# Altium schematic sheet IF_amp.SchDoc
size A4
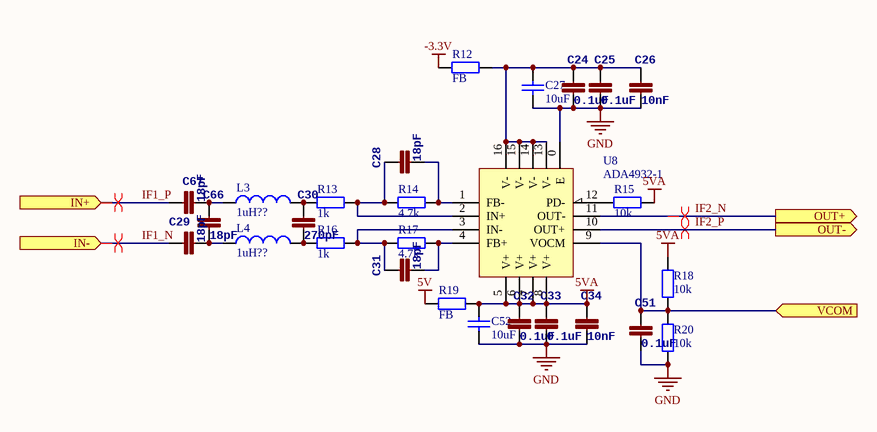
[diagram p0: IF_amp.SchDoc]

## Parts
C24  0.1uF  [0402]
C25  0.1uF  [0402]
C26  10nF  [0402]
C27  10uF  [0805]
C28  18pF  [0402]
C29  18pF  [0402]
C30  270pF  [0402]
C31  18pF  [0402]
C32  0.1uF  [0402]
C33  0.1uF  [0402]
C34  10nF  [0402]
C51  0.1uF  [0402]
C52  10uF  [0805]
C66  18pF  [0402]
C67  18pF  [0402]
L3  value 1uH??  [0805]  (hidden comment: Inductor)
L4  value 1uH??  [0805]  (hidden comment: Inductor)
R12  FB  [0603]
R13  value 1k  [0402]  (hidden comment: Res2)
R14  value 4.7k  [0402]  (hidden comment: Res2)
R15  value 10k  [0402]  (hidden comment: Res2)
R16  value 1k  [0402]  (hidden comment: Res2)
R17  value 4.7k  [0402]  (hidden comment: Res2)
R18  value 10k  [0402]  (hidden comment: Res2)
R19  FB  [0603]
R20  value 10k  [0402]  (hidden comment: Res2)
U8  ADA4932-1  [ADA4932-1]

## Ports
IN+ (in), IN- (in), OUT+ (out), OUT- (out), VCOM (in)

## Nets
5V: R19.1
5VA: C32.2 C33.2 C34.2 C52.1 R15.2 R18.2 R19.2 U8.5(V+) U8.6(V+) U8.7(V+) U8.8(V+)
-3.3V: R12.1
GND: C24.1 C25.1 C26.1 C27.2 C32.1 C33.1 C34.1 C51.1 C52.2 R20.1 U8.0(E)
IF1_N: C29.2 ; port IN-
IF1_P: C67.2 ; port IN+
IF2_N: U8.11(OUT-) ; port OUT+
IF2_P: U8.10(OUT+) ; port OUT-
VCOM: C51.2 R18.1 R20.2 U8.9(VOCM) ; port VCOM
NetC24_2: C24.2 C25.2 C26.2 C27.1 R12.2 U8.13(V-) U8.14(V-) U8.15(V-) U8.16(V-)
NetC28_1: C28.1 R14.2 U8.1(FB-)
NetC28_2: C28.2 R13.2 R14.1 U8.2(IN+)
NetC29_1: C29.1 C66.1 L4.1
NetC30_1: C30.1 L4.2 R16.1
NetC30_2: C30.2 L3.2 R13.1
NetC31_1: C31.1 R17.2 U8.4(FB+)
NetC31_2: C31.2 R16.2 R17.1 U8.3(IN-)
NetC66_2: C66.2 C67.1 L3.1
NetR15_1: R15.1 U8.12(PD-)

## Layout directives
differential pair: IF1_N, IF1_P, IF2_N, IF2_P

## Library data of the parts
C24-C26 C28-C34 C51 C66 C67 = CAP0402-CAP: <b>Capacitor</b> / Standard 0603 ceramic capacitor, and 0.1" leaded capacitor.; PARTNO: CC0402ZRY5V7BB104
C27 C52 = Cap: Capacitor; Published: 8-Jun-2000; LatestRevisionDate: 17-Jul-2002; LatestRevisionNote: Re-released for DXP Platform.; PackageReference: RAD-0.3; Publisher: Altium Limited; PackageDescription: Radial Cap, Thru-Hole; 2 Leads; 0.3 in Pin Spacing
L3 L4 = Inductor: Code_IEC: 1005; Published: 8-Jun-2000; LatestRevisionDate: 29-May-2009; LatestRevisionNote: IPC-7351 Footprint Added.; PackageReference: 0402-A; Publisher: Altium Limited; PackageDescription: Chip Inductor; Code_JEITA: 0402
R12 R19 = Res2: Resistor; Value: 0Ohm; Published: 8-Jun-2000; LatestRevisionDate: 17-Jul-2002; LatestRevisionNote: Re-released for DXP Platform.; PackageReference: AXIAL-0.4; Publisher: Altium Limited; PackageDescription: Axial Device, Thru-Hole; 2 Leads; 0.4 in Pin Spacing
R13-R18 R20 = Res2: Resistor; Published: 8-Jun-2000; LatestRevisionDate: 17-Jul-2002; LatestRevisionNote: Re-released for DXP Platform.; PackageReference: AXIAL-0.4; Publisher: Altium Limited; PackageDescription: Axial Device, Thru-Hole; 2 Leads; 0.4 in Pin Spacing